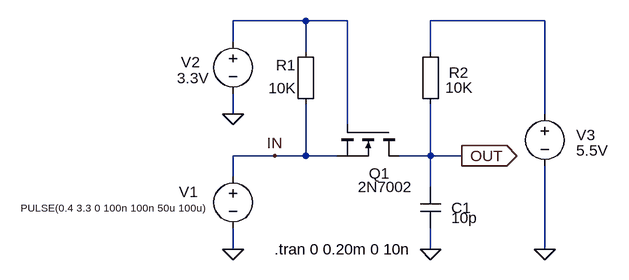
[diagram p0: schematic level_shifter_1.8-5.0_mosfet.asc]
level_shifter_1.8-5.0_mosfet.asc, the LTspice schematic file:
Version 4
SHEET 1 1856 840
WIRE 256 -224 144 -224
WIRE 320 -224 256 -224
WIRE 624 -224 448 -224
WIRE 144 -192 144 -224
WIRE 256 -176 256 -224
WIRE 448 -176 448 -224
WIRE 144 -80 144 -112
WIRE 624 -80 624 -224
WIRE 320 -64 320 -224
WIRE 208 -16 144 -16
WIRE 256 -16 256 -96
WIRE 256 -16 208 -16
WIRE 304 -16 256 -16
WIRE 448 -16 448 -96
WIRE 448 -16 400 -16
WIRE 496 -16 448 -16
WIRE 144 16 144 -16
WIRE 448 32 448 -16
WIRE 144 128 144 96
WIRE 448 128 448 96
WIRE 624 128 624 0
FLAG 144 128 0
FLAG 624 128 0
FLAG 496 -16 OUT
IOPIN 496 -16 Out
FLAG 208 -16 IN
FLAG 448 128 0
FLAG 144 -80 0
SYMBOL voltage 144 0 R0
WINDOW 0 -54 40 Right 2
WINDOW 3 -48 64 Right 1
WINDOW 123 0 0 Left 2
WINDOW 39 -81 91 Left 2
SYMATTR InstName V1
SYMATTR Value PULSE(0.4 3.3 0 100n 100n 50u 100u)
SYMBOL Misc\\EuropeanResistor 432 -192 R0
WINDOW 0 44 48 Left 2
WINDOW 3 39 71 Left 2
SYMATTR InstName R2
SYMATTR Value 10K
SYMATTR SpiceLine tol=1 pwr=0.1
SYMBOL voltage 624 -96 R0
WINDOW 0 48 48 Left 2
WINDOW 3 48 72 Left 2
WINDOW 123 0 0 Left 2
WINDOW 39 -81 91 Left 2
SYMATTR InstName V3
SYMATTR Value 5.5V
SYMBOL cap 432 32 R0
WINDOW 0 48 32 Left 2
WINDOW 3 48 48 Left 2
SYMATTR InstName C1
SYMATTR Value 10p
SYMBOL voltage 144 -208 R0
WINDOW 0 -80 48 Left 2
WINDOW 3 -86 72 Left 2
WINDOW 123 0 0 Left 2
WINDOW 39 -81 91 Left 2
SYMATTR InstName V2
SYMATTR Value 3.3V
SYMBOL nmos 400 -64 R90
WINDOW 0 75 47 VLeft 2
WINDOW 3 96 64 VLeft 2
SYMATTR InstName Q1
SYMATTR Value 2N7002
SYMBOL Misc\\EuropeanResistor 272 -80 R180
WINDOW 0 31 76 Left 2
WINDOW 3 31 40 Left 2
SYMATTR InstName R1
SYMATTR Value 10K
SYMATTR SpiceLine tol=1 pwr=0.1
TEXT 208 128 Left 2 !.tran 0 0.20m 0 10n

The netlist it stands for:
* level_shifter_1.8-5.0_mosfet.asc
V1 IN 0 PULSE(0.4 3.3 0 100n 100n 50u 100u)
R2 N002 OUT 10K tol=1 pwr=0.1
V3 N002 0 5.5V
C1 OUT 0 10p
V2 N001 0 3.3V
M§Q1 OUT N001 IN IN 2N7002
R1 IN N001 10K tol=1 pwr=0.1
.model NMOS NMOS
.model PMOS PMOS
.lib standard.mos
.tran 0 0.20m 0 10n
.backanno
.end